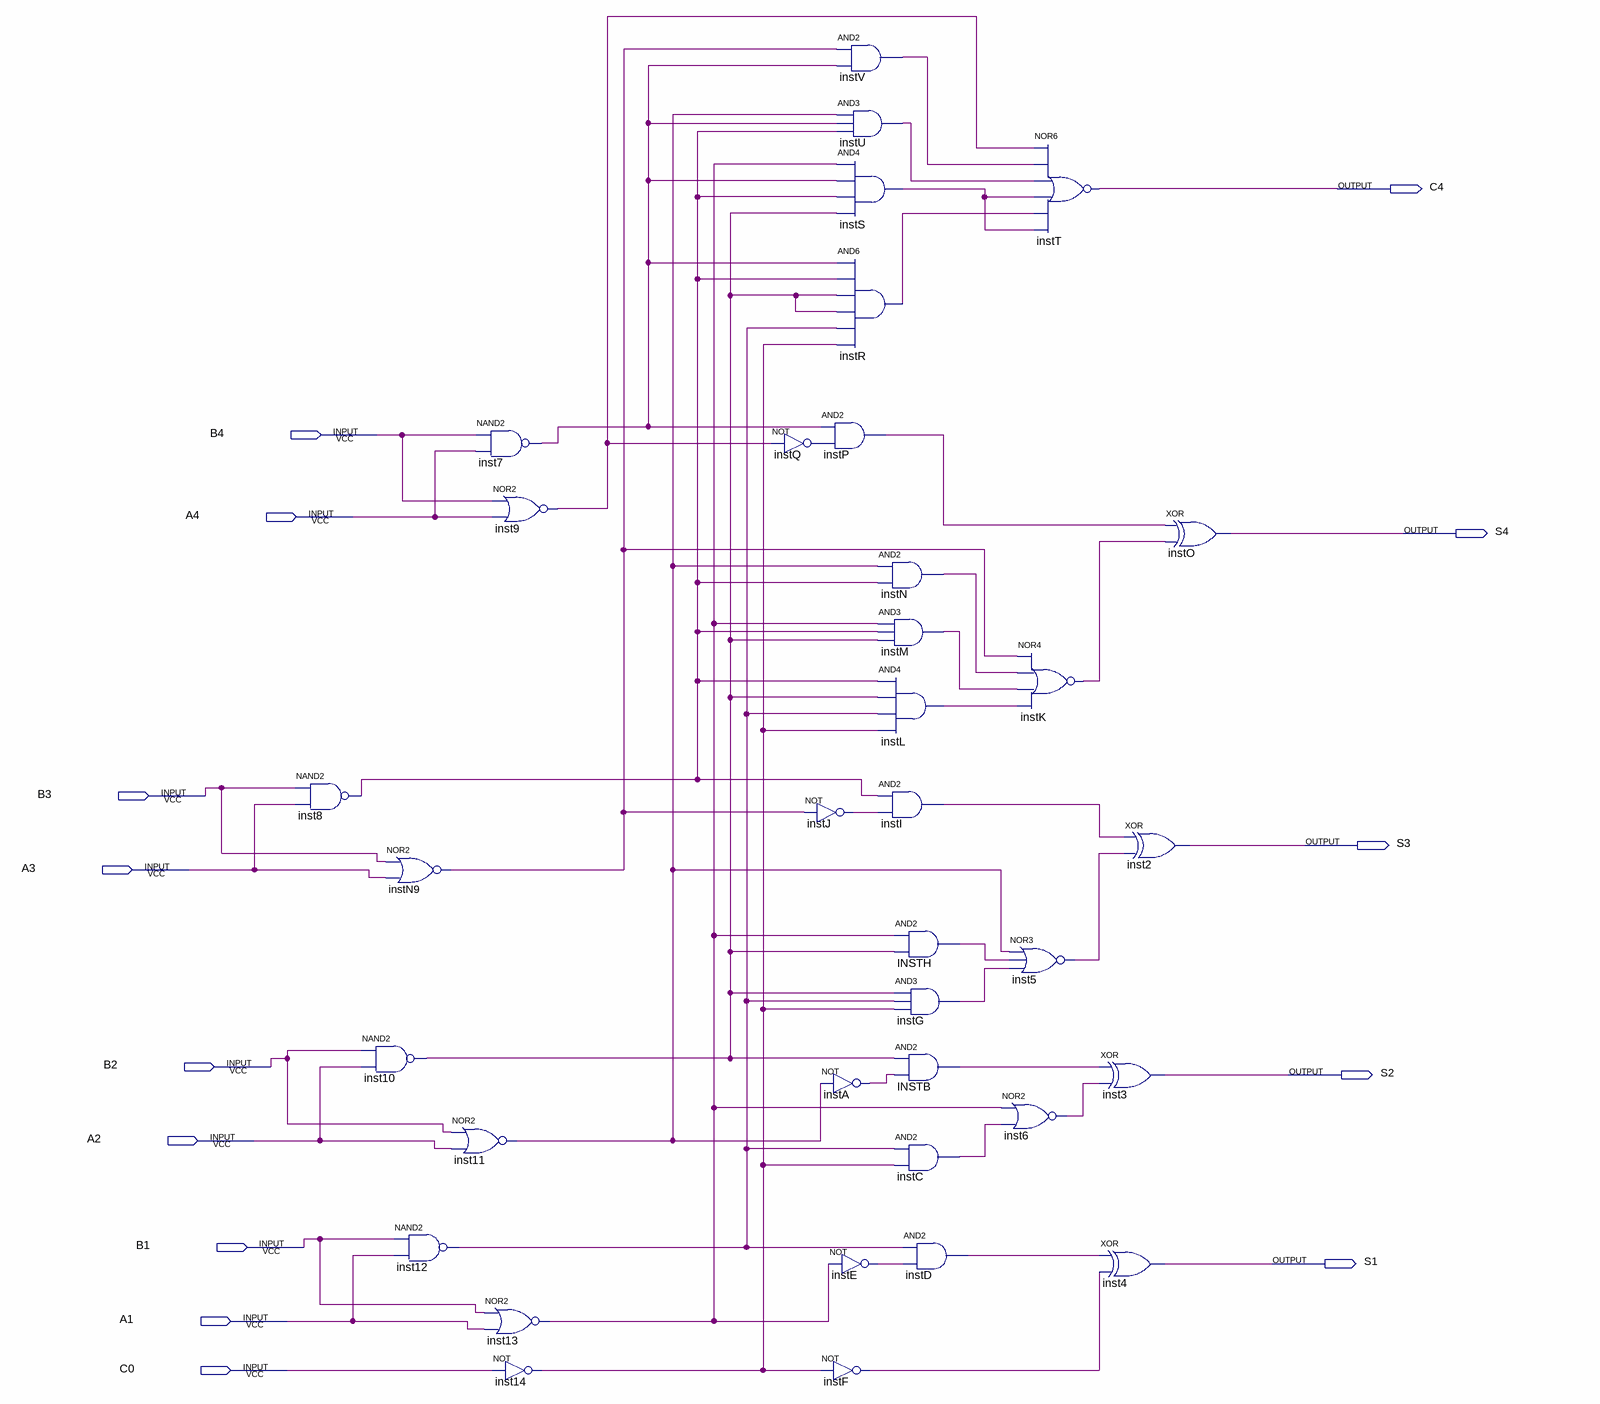
[diagram p0: schematic sheet]
// Quartus schematic ci7483.bdf as structural Verilog: 36 symbols, 14 pins
module ci7483 (
  input  B4,
  input  A4,
  input  B3,
  input  A3,
  input  B2,
  input  A2,
  input  B1,
  input  A1,
  input  C0,
  output C4,
  output S4,
  output S3,
  output S2,
  output S1
);

  wire inst5_out, inst6_out, inst7_out, inst8_out, inst9_out, inst10_out, inst11_out, inst12_out, inst13_out,
       inst14_out, instA_out, INSTB_out, instC_out, instD_out, instE_out, instF_out, instG_out, INSTH_out,
       instI_out, instJ_out, instK_out, instL_out, instM_out, instN9_out, instN_out, instP_out, instQ_out,
       instR_out, instS_out, instU_out, instV_out;

  nand inst8 (inst8_out, B3, A3);
  nor instN9 (instN9_out, B3, A3);
  nand inst10 (inst10_out, B2, A2);
  nand inst12 (inst12_out, B1, A1);
  nor inst11 (inst11_out, B2, A2);
  nand inst7 (inst7_out, B4, A4);
  nor inst9 (inst9_out, B4, A4);
  nor inst13 (inst13_out, B1, A1);
  not inst14 (inst14_out, C0);
  not instQ (instQ_out, inst9_out);
  and instV (instV_out, instN9_out, inst7_out);
  and instU (instU_out, inst11_out, inst7_out, inst8_out);
  and instS (instS_out, inst13_out, inst7_out, inst8_out, inst10_out);
  and instR (instR_out, inst7_out, inst8_out, inst10_out, inst10_out, inst12_out, inst14_out);
  and instP (instP_out, inst7_out, instQ_out);
  not instJ (instJ_out, instN9_out);
  not instA (instA_out, inst11_out);
  not instE (instE_out, inst13_out);
  not instF (instF_out, inst14_out);
  and instN (instN_out, inst11_out, inst8_out);
  and instM (instM_out, inst13_out, inst8_out, inst10_out);
  and instL (instL_out, inst8_out, inst10_out, inst12_out, inst14_out);
  and instI (instI_out, inst8_out, instJ_out);
  and INSTH (INSTH_out, inst13_out, inst10_out);
  and instG (instG_out, inst10_out, inst12_out, inst14_out);
  and INSTB (INSTB_out, inst10_out, instA_out);
  and instC (instC_out, inst12_out, inst14_out);
  and instD (instD_out, inst12_out, instE_out);
  nor instT (C4, inst9_out, instV_out, instU_out, instS_out, instR_out, instS_out);
  nor instK (instK_out, instN9_out, instN_out, instM_out, instL_out);
  nor inst5 (inst5_out, inst11_out, INSTH_out, instG_out);
  nor inst6 (inst6_out, inst13_out, instC_out);
  xor inst2 (S3, instI_out, inst5_out);
  xor inst3 (S2, INSTB_out, inst6_out);
  xor inst4 (S1, instD_out, instF_out);
  xor instO (S4, instP_out, instK_out);
endmodule
